# Altium project CDRon.PrjPcb
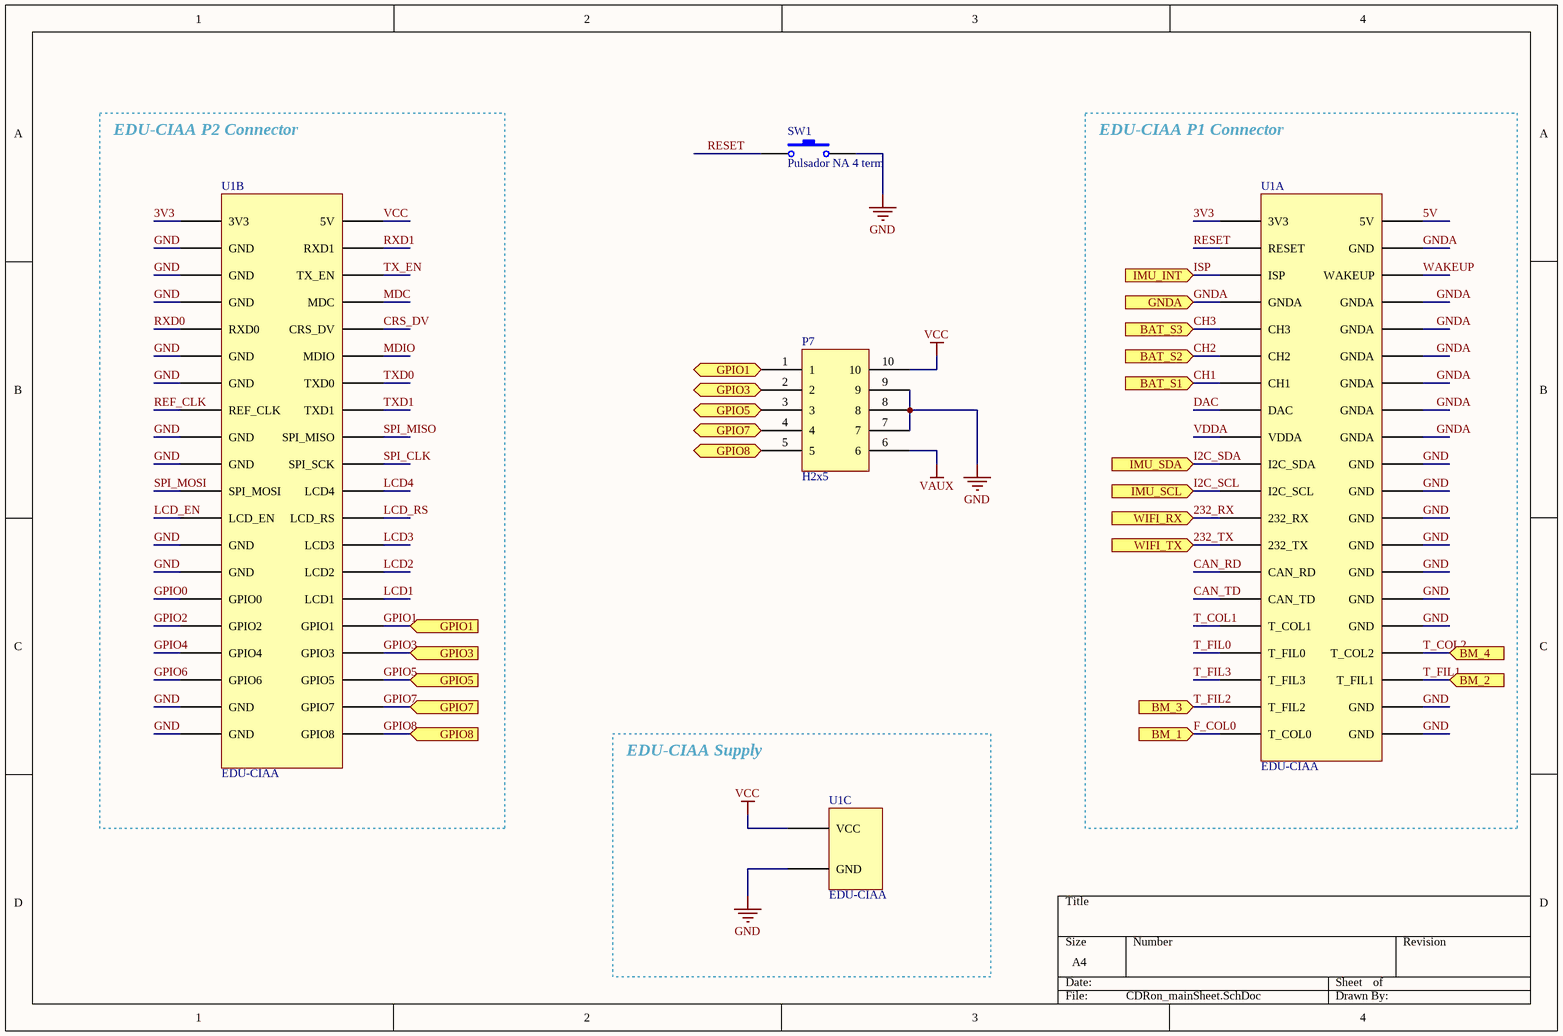
[diagram p0: CDRon_mainSheet.SchDoc]
4 sheets, 23 parts. Net scope: flat (ports and power ports of the same name join across sheets).
Board file: CDRon_PCB.PcbDoc
Sheets:
  CDRon_mainSheet.SchDoc
  CDRon_brushless.SchDoc
  CDRon_wifi.SchDoc
  CDRon_IMU-BAT.SchDoc

## Sheet CDRon_mainSheet.SchDoc
size A4

### Parts
P7  H2x5  [H2x5]
SW1  Pulsador NA 4 term  [TACT SW]
U1  EDU-CIAA  [EDU-CIAA]  (parts A,B,C of 3)

### Blocks framed on the sheet
EDU-CIAA P2 Connector: U1
EDU-CIAA P1 Connector: U1
EDU-CIAA Supply: U1

### Ports
BAT_S1 (in), BAT_S2 (in), BAT_S3 (in), BM_1 (in), BM_2 (in), BM_3 (in), BM_4 (in), GNDA (in), GPIO1 (in), GPIO3 (in), GPIO5 (in), GPIO7 (in), GPIO8 (in), IMU_INT (in), IMU_SCL (in), IMU_SDA (in), WIFI_RX (in), WIFI_TX (in)

### Nets
GND: P7.7 P7.8 P7.9 SW1.2 U1.20(GND) U1.22(GND) U1.24(GND) U1.26(GND) U1.28(GND) U1.30(GND) U1.32(GND) U1.38(GND) U1.40(GND) U1.43(GND) U1.45(GND) U1.47(GND) U1.51(GND) U1.53(GND) U1.57(GND) U1.59(GND) U1.65(GND) U1.67(GND) U1.77(GND) U1.79(GND) U1.82(GND)
VAUX: P7.6
VCC: P7.10 U1.42(5V) U1.81(VCC)
3V3: U1.1(3V3) U1.41(3V3)
5V: U1.2(5V)
232_RX: U1.23(232_RX) ; port WIFI_RX
232_TX: U1.25(232_TX) ; port WIFI_TX
CAN_RD: U1.27(CAN_RD)
CAN_TD: U1.29(CAN_TD)
CH1: U1.13(CH1) ; port BAT_S1
CH2: U1.11(CH2) ; port BAT_S2
CH3: U1.9(CH3) ; port BAT_S3
CRS_DV: U1.50(CRS_DV)
DAC: U1.15(DAC)
F_COL0: U1.39(T_COL0) ; port BM_1
GNDA: U1.4(GND) U1.7(GNDA) U1.8(GNDA) U1.10(GNDA) U1.12(GNDA) U1.14(GNDA) U1.16(GNDA) U1.18(GNDA) ; port GNDA
GPIO0: U1.69(GPIO0)
GPIO1: P7.1 U1.72(GPIO1) ; port GPIO1
GPIO2: U1.71(GPIO2)
GPIO3: P7.2 U1.74(GPIO3) ; port GPIO3
GPIO4: U1.73(GPIO4)
GPIO5: P7.3 U1.76(GPIO5) ; port GPIO5
GPIO6: U1.75(GPIO6)
GPIO7: P7.4 U1.78(GPIO7) ; port GPIO7
GPIO8: P7.5 U1.80(GPIO8) ; port GPIO8
I2C_SCL: U1.21(I2C_SCL) ; port IMU_SCL
I2C_SDA: U1.19(I2C_SDA) ; port IMU_SDA
ISP: U1.5(ISP) ; port IMU_INT
LCD1: U1.70(LCD1)
LCD2: U1.68(LCD2)
LCD3: U1.66(LCD3)
LCD4: U1.62(LCD4)
LCD_EN: U1.63(LCD_EN)
LCD_RS: U1.64(LCD_RS)
MDC: U1.48(MDC)
MDIO: U1.52(MDIO)
REF_CLK: U1.55(REF_CLK)
RESET: SW1.1 U1.3(RESET)
RXD0: U1.49(RXD0)
RXD1: U1.44(RXD1)
SPI_CLK: U1.60(SPI_SCK)
SPI_MISO: U1.58(SPI_MISO)
SPI_MOSI: U1.61(SPI_MOSI)
T_COL1: U1.31(T_COL1)
T_COL2: U1.34(T_COL2) ; port BM_4
T_FIL0: U1.33(T_FIL0)
T_FIL1: U1.36(T_FIL1) ; port BM_2
T_FIL2: U1.37(T_FIL2) ; port BM_3
T_FIL3: U1.35(T_FIL3)
TX_EN: U1.46(TX_EN)
TXD0: U1.54(TXD0)
TXD1: U1.56(TXD1)
VDDA: U1.17(VDDA)
WAKEUP: U1.6(WAKEUP)

### Library data of the parts
SW1 = Pulsador NA 4 term: .Creator: G; .PCBCheck: G; .SCHCheck: G

## Sheet CDRon_brushless.SchDoc
size A4
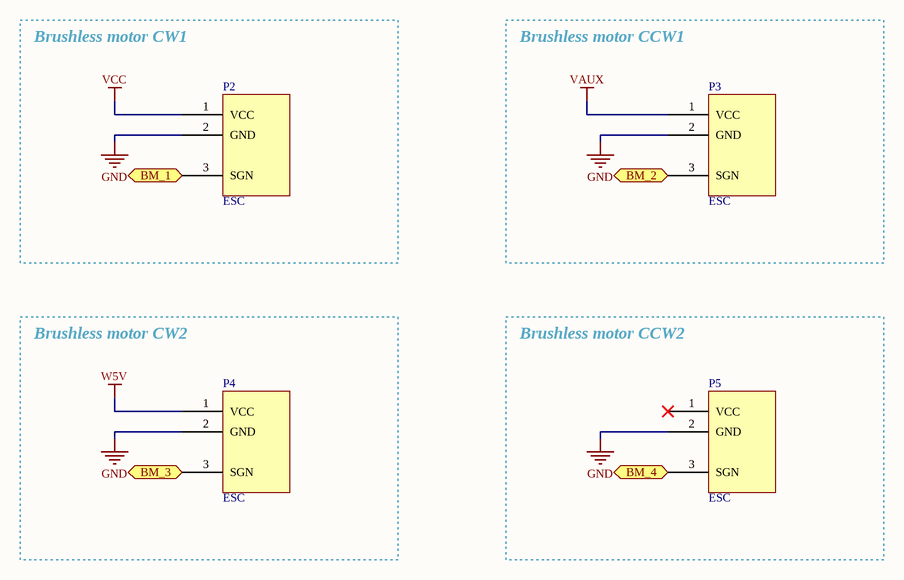
[diagram p1: CDRon_brushless.SchDoc]

### Parts
P2  ESC  [ESC]
P3  ESC  [ESC]
P4  ESC  [ESC]
P5  ESC  [ESC]

### Blocks framed on the sheet
Brushless motor CW1: P2
Brushless motor CCW1: P3
Brushless motor CW2: P4
Brushless motor CCW2: P5

### Ports
BM_1 (in), BM_2 (in), BM_3 (in), BM_4 (in)

### Nets
GND: P2.2(GND) P3.2(GND) P4.2(GND) P5.2(GND)
VAUX: P3.1(VCC)
VCC: P2.1(VCC)
W5V: P4.1(VCC)
F_COL0: P2.3(SGN) ; port BM_1
T_COL2: P5.3(SGN) ; port BM_4
T_FIL1: P3.3(SGN) ; port BM_2
T_FIL2: P4.3(SGN) ; port BM_3

Not connected (* = marked no-connect by the designer): P5 1(VCC)*

## Sheet CDRon_wifi.SchDoc
size A4
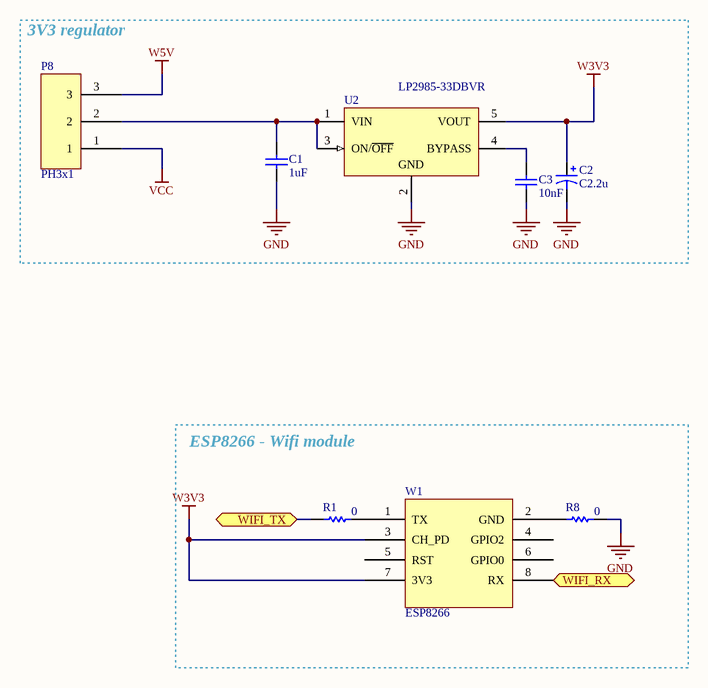
[diagram p2: CDRon_wifi.SchDoc]

### Parts
C1  value 1uF  [0805]  (hidden comment: C1u)
C2  C2.2u  [Tantalum]
C3  value 10nF  [C 1206]  (hidden comment: C10n)
P8  PH3x1  [PH3x1]
R1  0  [R 1206]
R8  0  [R 1206]
U2  LP2985-33DBVR  [TI-DBV5_N]
W1  ESP8266  [ESP8266]

### Blocks framed on the sheet
3V3 regulator: C1-C3 P8 U2
ESP8266 - Wifi module: R1 R8 W1

### Ports
WIFI_RX (in), WIFI_TX

### Nets
GND: C1.1 C2.2 C3.1 R8.2 U2.2(GND)
VCC: P8.1
W3V3: C2.1 U2.5(VOUT) W1.3(CH_PD) W1.7(3V3)
W5V: P8.3
232_RX: W1.8(RX) ; port WIFI_RX
232_TX: R1.1 ; port WIFI_TX
NetC1_2: C1.2 P8.2 U2.1(VIN) U2.3(ON/~{OFF})
NetC3_2: C3.2 U2.4(BYPASS)
NetR1_2: R1.2 W1.1(TX)
NetR8_1: R8.1 W1.2(GND)

Not connected (* = marked no-connect by the designer): W1 4(GPIO2) 5(RST) 6(GPIO0)

### Library data of the parts
C1 C3 = C: Cap ceramic
C2 = C Tantalum: Tantalum capacitor
R1 R8 = R: Resistencia; .Creator: SR; .PCBCheck: Used; .SCHCheck: Used; Category: Resistencias
U2 = LP2985-10DBVR: Single Output Low Noise LDO, 150 mA, Fixed 3.3 V Output, 2.2 to 16 V Input, with Low IQ, 5-pin SOT-23 (DBV), -40 to 125 degC, Green (RoHS & no Sb/Br); Manufacturer: Texas Instruments; Accuracy(%): 1.5; Fixed Output Options(V): 3.3; Iout(Max)(A): 0.15; Iq(Typ)(mA): 0.85; SubFamily: Single Channel LDO; Vdo(Typ)(mV): 280; Vin(Max)(V): 16; Vin(Min)(V): 2.2; DatasheetVersion: SLVS522N; PackageVersion: 4073253-4/K; PackageReference: DBV5; PackageDescription: 5-Pin Plastic Small Outline, Body 1.60 Ã— 2.90 mm, Pitch 0.95 mm; Eco-Plan: Green (RoHS & no Sb/Br); Vout Adj(Max)(V): 3.3; Vout Adj(Min)(V): 3.3; Mounting Technology: Surface Mount; Code_JEDEC: MO-178; PartNumber: LP2985-33DBVR; ComponentLink1Description: Manufacturer URL; ComponentLink1URL: http://www.ti.com/; ComponentLink2Description: Datasheet; ComponentLink2URL: http://www.ti.com/general/docs/lit/getliterature.tsp?genericPartNumber=LP2985-10&fileType=pdf; ComponentLink3Description: Package Specification; ComponentLink3URL: http://www.ti.com/litv/pdf/mpds018i; Supplier 1: Farnell; Supplier Part Number 1: 2412118; Supplier 2: Digi-Key; Supplier Part Number 2: 296-18476-6-ND

## Sheet CDRon_IMU-BAT.SchDoc
size A4
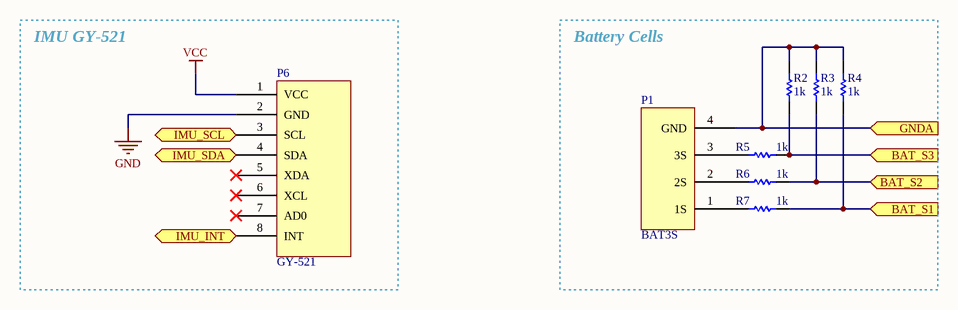
[diagram p3: CDRon_IMU-BAT.SchDoc]

### Parts
P1  BAT3S  [BAT3S]
P6  GY-521  [GY-521]
R2  1k  [R 1206]
R3  1k  [R 1206]
R4  1k  [R 1206]
R5  1k  [R 1206]
R6  1k  [R 1206]
R7  1k  [R 1206]

### Blocks framed on the sheet
IMU GY-521: P6
Battery Cells: P1 R2-R7

### Ports
BAT_S1 (in), BAT_S2 (in), BAT_S3 (in), GNDA (in), IMU_INT (in), IMU_SCL (in), IMU_SDA (in)

### Nets
GND: P6.2(GND)
VCC: P6.1(VCC)
CH1: R4.1 R7.2 ; port BAT_S1
CH2: R3.1 R6.2 ; port BAT_S2
CH3: R2.1 R5.2 ; port BAT_S3
GNDA: P1.4(GND) R2.2 R3.2 R4.2 ; port GNDA
I2C_SCL: P6.3(SCL) ; port IMU_SCL
I2C_SDA: P6.4(SDA) ; port IMU_SDA
ISP: P6.8(INT) ; port IMU_INT
NetP1_1: P1.1(1S) R7.1
NetP1_2: P1.2(2S) R6.1
NetP1_3: P1.3(3S) R5.1

Not connected (* = marked no-connect by the designer): P6 5(XDA)* 6(XCL)* 7(AD0)*

### Library data of the parts
R2-R7 = R: as R1 on sheet CDRon_wifi; .SCHCheck: Used; Category: Resistencias

## Nets that join several sheets
GND: CDRon_mainSheet (25 pins), CDRon_brushless (P2.2 P3.2 P4.2 P5.2), CDRon_wifi (5 pins), CDRon_IMU-BAT (P6.2)
VAUX: CDRon_mainSheet (P7.6), CDRon_brushless (P3.1)
VCC: CDRon_mainSheet (P7.10 U1.42 U1.81), CDRon_brushless (P2.1), CDRon_wifi (P8.1), CDRon_IMU-BAT (P6.1)
W5V: CDRon_brushless (P4.1), CDRon_wifi (P8.3)
232_RX: CDRon_mainSheet (U1.23), CDRon_wifi (W1.8)
232_TX: CDRon_mainSheet (U1.25), CDRon_wifi (R1.1)
CH1: CDRon_mainSheet (U1.13), CDRon_IMU-BAT (R4.1 R7.2)
CH2: CDRon_mainSheet (U1.11), CDRon_IMU-BAT (R3.1 R6.2)
CH3: CDRon_mainSheet (U1.9), CDRon_IMU-BAT (R2.1 R5.2)
F_COL0: CDRon_mainSheet (U1.39), CDRon_brushless (P2.3)
GNDA: CDRon_mainSheet (8 pins), CDRon_IMU-BAT (P1.4 R2.2 R3.2 R4.2)
I2C_SCL: CDRon_mainSheet (U1.21), CDRon_IMU-BAT (P6.3)
I2C_SDA: CDRon_mainSheet (U1.19), CDRon_IMU-BAT (P6.4)
ISP: CDRon_mainSheet (U1.5), CDRon_IMU-BAT (P6.8)
T_COL2: CDRon_mainSheet (U1.34), CDRon_brushless (P5.3)
T_FIL1: CDRon_mainSheet (U1.36), CDRon_brushless (P3.3)
T_FIL2: CDRon_mainSheet (U1.37), CDRon_brushless (P4.3)